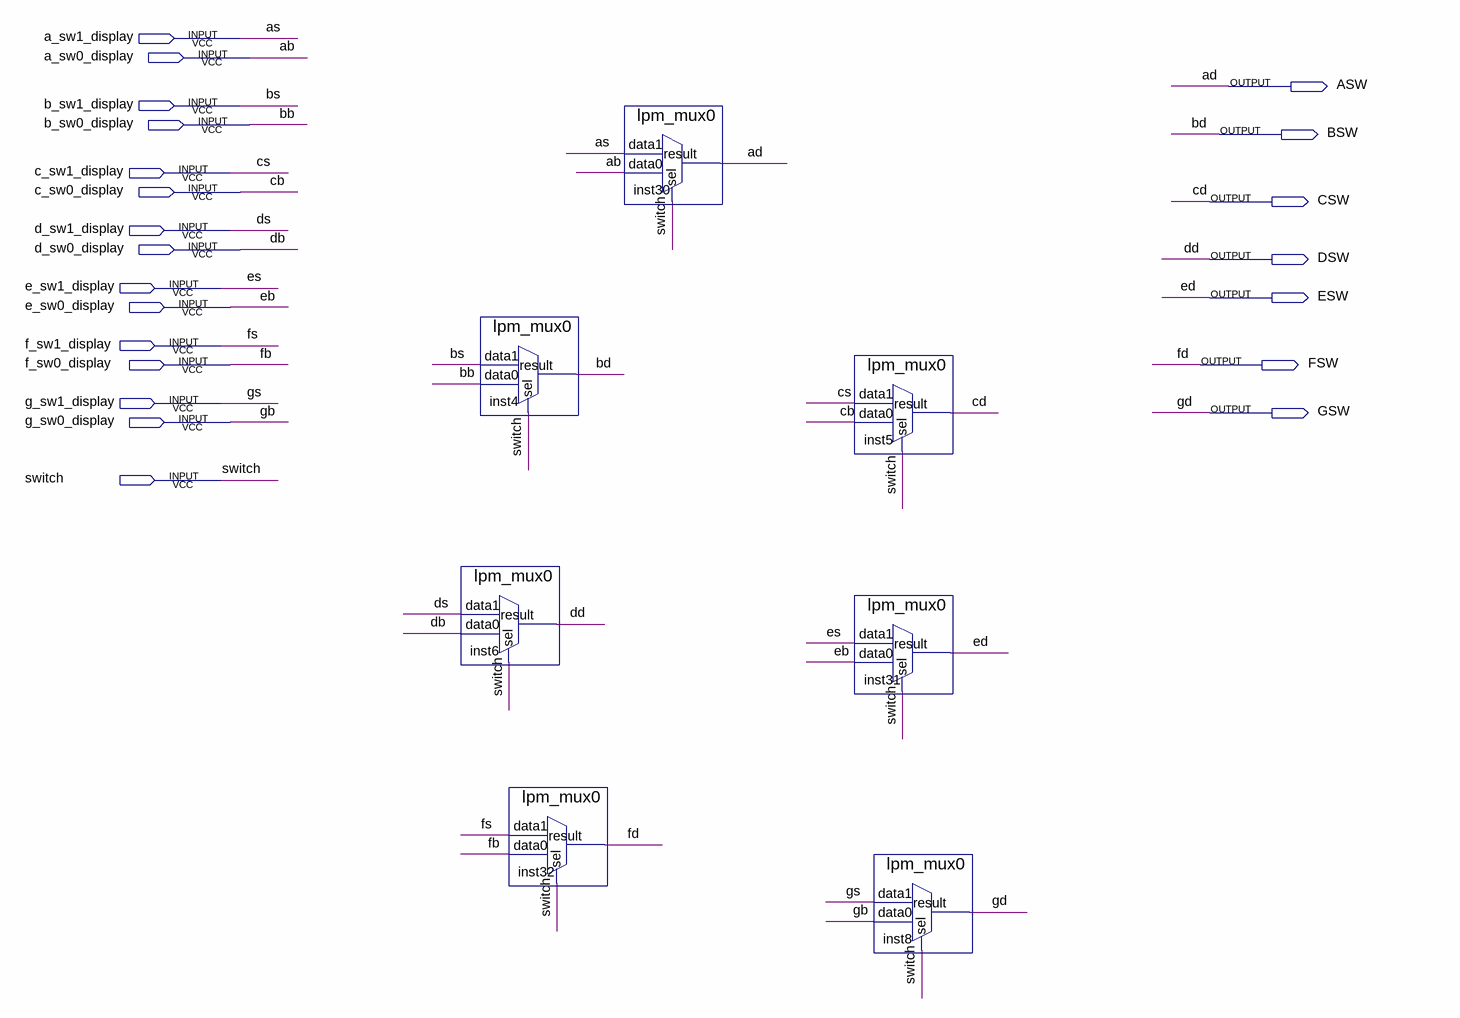
[diagram p0: schematic sheet]
// Quartus schematic switch_display.bdf as structural Verilog: 7 symbols, 22 pins
module switch_display (
  input  a_sw1_display,
  input  a_sw0_display,
  input  b_sw1_display,
  input  b_sw0_display,
  input  c_sw1_display,
  input  c_sw0_display,
  input  d_sw1_display,
  input  d_sw0_display,
  input  e_sw1_display,
  input  e_sw0_display,
  input  f_sw1_display,
  input  f_sw0_display,
  input  g_sw1_display,
  input  g_sw0_display,
  input  switch,
  output ASW,
  output BSW,
  output CSW,
  output DSW,
  output ESW,
  output FSW,
  output GSW
);

  lpm_mux0 inst4 (.data1(b_sw1_display), .data0(b_sw0_display), .sel(switch), .result(BSW));
  lpm_mux0 inst6 (.data1(d_sw1_display), .data0(d_sw0_display), .sel(switch), .result(DSW));
  lpm_mux0 inst32 (.data1(f_sw1_display), .data0(f_sw0_display), .sel(switch), .result(FSW));
  lpm_mux0 inst30 (.data1(a_sw1_display), .data0(a_sw0_display), .sel(switch), .result(ASW));
  lpm_mux0 inst5 (.data1(c_sw1_display), .data0(c_sw0_display), .sel(switch), .result(CSW));
  lpm_mux0 inst31 (.data1(e_sw1_display), .data0(e_sw0_display), .sel(switch), .result(ESW));
  lpm_mux0 inst8 (.data1(g_sw1_display), .data0(g_sw0_display), .sel(switch), .result(GSW));

  // Other names for the same wires on the sheet: ab = a_sw0_display; ad = ASW; as = a_sw1_display; bb = b_sw0_display;
  //   bd = BSW; bs = b_sw1_display; cb = c_sw0_display; cd = CSW; cs = c_sw1_display; db = d_sw0_display; dd = DSW;
  //   ds = d_sw1_display; eb = e_sw0_display; ed = ESW; es = e_sw1_display; fb = f_sw0_display; fd = FSW;
  //   fs = f_sw1_display; gb = g_sw0_display; gd = GSW; gs = g_sw1_display
endmodule
